# Altium schematic sheet 02-USER_IO.SchDoc
size Tabloid; DocumentNumber: 1; SheetNumber: 2; SheetTotal: 14
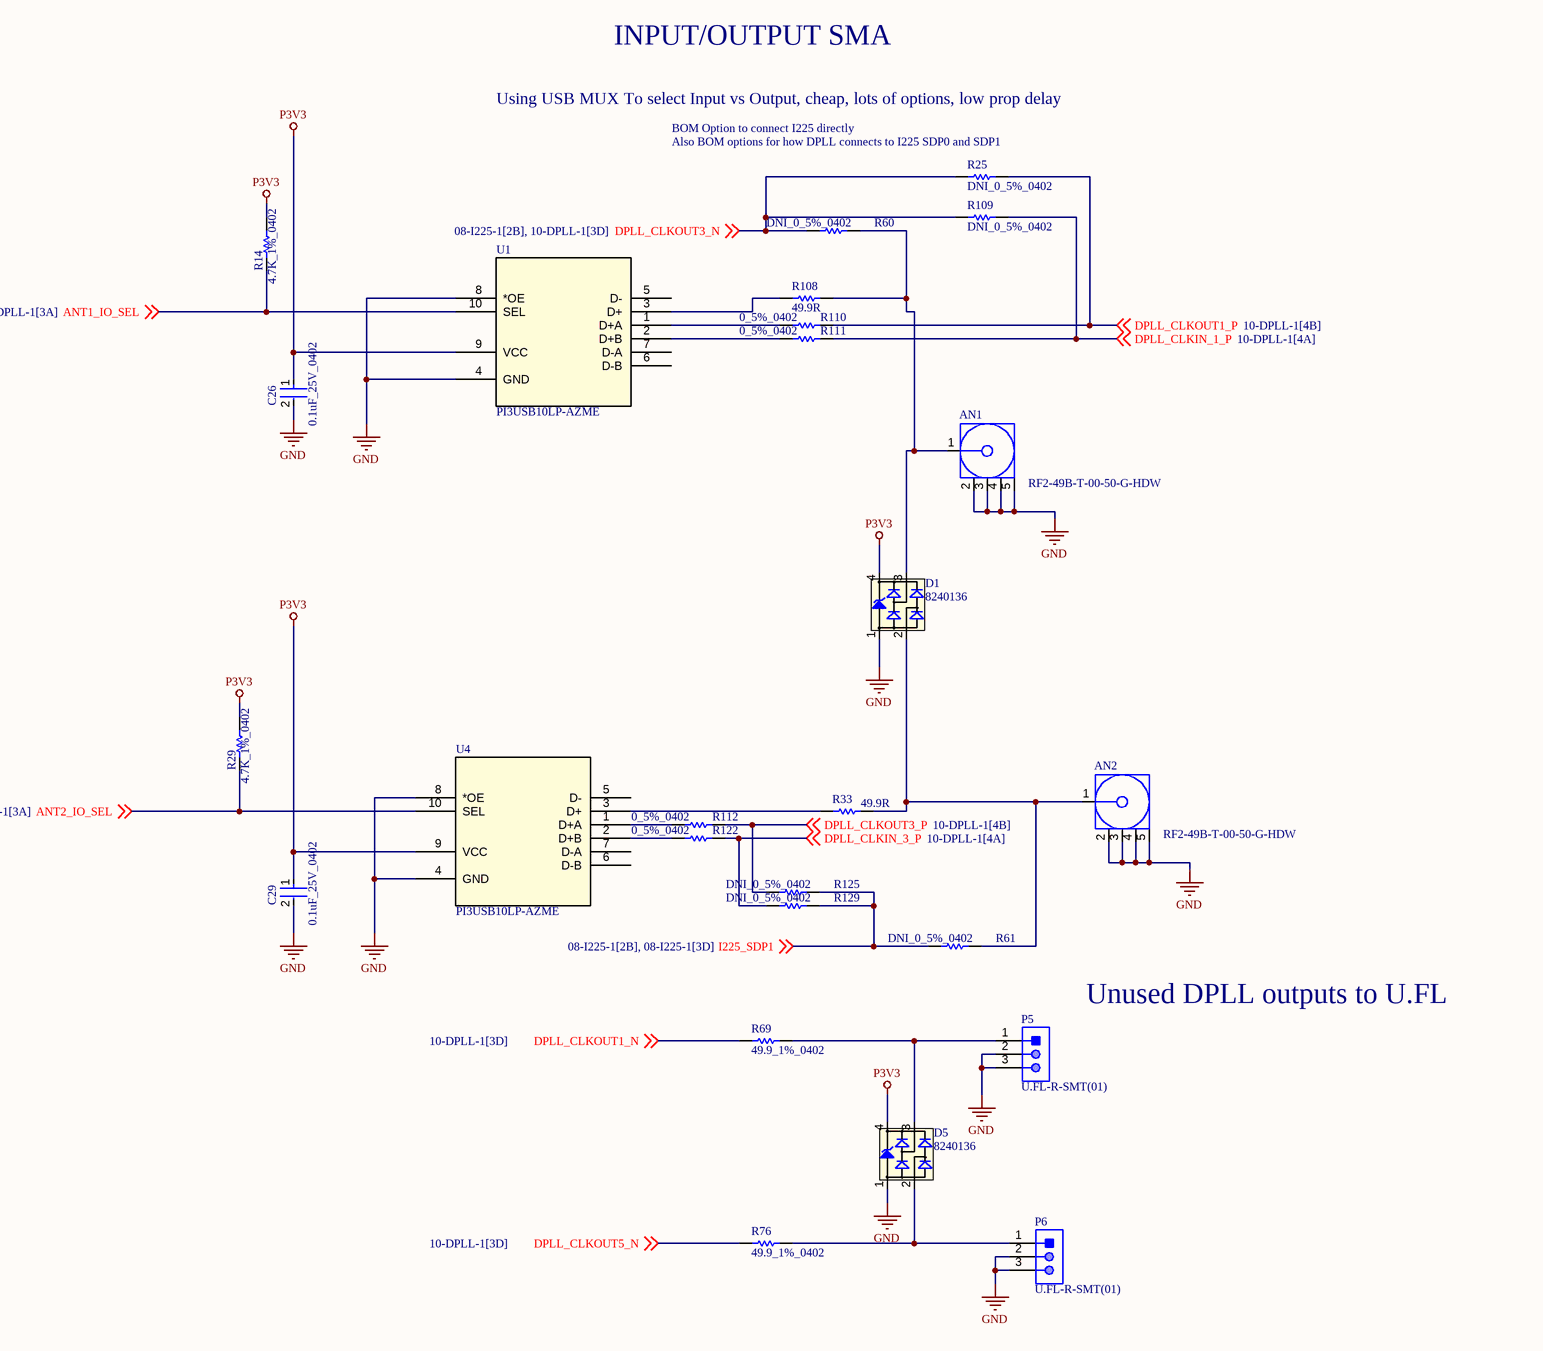
[diagram p0: 02-USER_IO.SchDoc]

## Parts
AN1  RF2-49B-T-00-50-G-HDW  [AMPH-901-143-6RFX_V]
AN2  RF2-49B-T-00-50-G-HDW  [AMPH-901-143-6RFX_V]
C26  0.1uF_25V_0402  [FP-0402-L_1_0_1-W_0_5_0_1-IPC_C]
C29  0.1uF_25V_0402  [FP-0402-L_1_0_1-W_0_5_0_1-IPC_C]
D1  8240136  [SOT143-4L]
D5  8240136  [SOT143-4L]
P5  U.FL-R-SMT(01)  [HRS-U.FL-R-SMT(10)_V]
P6  U.FL-R-SMT(01)  [HRS-U.FL-R-SMT(10)_V]
R14  4.7K_1%_0402  [RESC1005X40X25NL10T10]
R25  DNI_0_5%_0402  [RESC1005X40X25LL10T10]  (no BOM)
R29  4.7K_1%_0402  [RESC1005X40X25NL10T10]
R33  49.9R  [RESC1608X55X25NL10T15]
R60  DNI_0_5%_0402  [RESC1005X40X25LL10T10]  (no BOM)
R61  DNI_0_5%_0402  [RESC1005X40X25LL10T10]  (no BOM)
R69  49.9_1%_0402  [RESC1005X40X25NL10T10]
R76  49.9_1%_0402  [RESC1005X40X25NL10T10]
R108  49.9R  [RESC1608X55X25NL10T15]
R109  DNI_0_5%_0402  [RESC1005X40X25LL10T10]  (no BOM)
R110  0_5%_0402  [RESC1005X40X25LL10T10]
R111  0_5%_0402  [RESC1005X40X25LL10T10]
R112  0_5%_0402  [RESC1005X40X25LL10T10]
R122  0_5%_0402  [RESC1005X40X25LL10T10]
R125  DNI_0_5%_0402  [RESC1005X40X25LL10T10]  (no BOM)
R129  DNI_0_5%_0402  [RESC1005X40X25LL10T10]  (no BOM)
U1  PI3USB10LP-AZME  [ZM10_PER]
U4  PI3USB10LP-AZME  [ZM10_PER]

## Nets
GND: AN1.2 AN1.3 AN1.4 AN1.5 AN2.2 AN2.3 AN2.4 AN2.5 C26.2 C29.2 D1.1(GND) D5.1(GND) P5.2 P5.3 P6.2 P6.3 U1.4(GND) U1.8(*OE) U4.4(GND) U4.8(*OE)
P3V3: C26.1 C29.1 D1.4(VDD) D5.4(VDD) R14.1 R29.1 U1.9(VCC) U4.9(VCC)
ANT1_IO_SEL: R14.2 U1.10(SEL) ; off-sheet ANT1_IO_SEL
ANT2_IO_SEL: R29.2 U4.10(SEL) ; off-sheet ANT2_IO_SEL
DPLL_CLKIN_1_P: R109.1 R111.2 ; off-sheet DPLL_CLKIN_1_P
DPLL_CLKIN_3_P: R122.2 R129.1 ; off-sheet DPLL_CLKIN_3_P
DPLL_CLKOUT1_N: R69.1 ; off-sheet DPLL_CLKOUT1_N
DPLL_CLKOUT1_P: R25.1 R110.2 ; off-sheet DPLL_CLKOUT1_P
DPLL_CLKOUT3_N: R25.2 R60.1 R109.2 ; off-sheet DPLL_CLKOUT3_N
DPLL_CLKOUT3_P: R112.2 R125.1 ; off-sheet DPLL_CLKOUT3_P
DPLL_CLKOUT5_N: R76.1 ; off-sheet DPLL_CLKOUT5_N
I225_SDP1: R61.1 R125.2 R129.2 ; off-sheet I225_SDP1
NetAN1_1: AN1.1 D1.3(I/O2) R60.2 R108.1
NetAN2_1: AN2.1 D1.2(I/O1) R33.2 R61.2
NetD5_2: D5.2(I/O1) P6.1 R76.2
NetD5_3: D5.3(I/O2) P5.1 R69.2
NetR33_1: R33.1 U4.3(D+)
NetR108_2: R108.2 U1.3(D+)
NetR110_1: R110.1 U1.1(D+A)
NetR111_1: R111.1 U1.2(D+B)
NetR112_1: R112.1 U4.1(D+A)
NetR122_1: R122.1 U4.2(D+B)

Not connected (* = marked no-connect by the designer): U1 5(D-) 6(D-B) 7(D-A); U4 5(D-) 6(D-B) 7(D-A)

## Notes on the sheet
- INPUT/OUTPUT SMA
- Using USB MUX To select Input vs Output, cheap, lots of options, low prop delay
- BOM Option to connect I225 directly
- (near R25) Also BOM options for how DPLL connects to I225 SDP0 and SDP1
- Unused DPLL outputs to U.FL
- SHEET
- REV
- timingcard.com <http://timingcard.com>
- DATE
- OF

## Library data of the parts
AN1 AN2 = CMP-2000-05705-1: Coaxial connector, 50 Ohm, -65 to 165 degC, 5-Pin THD, RoHS, Bulk; Manufacturer: Amphenol; Catalog Drawings: 901-143-6RFXMountingHole; 3D Model: 901-143-6RFX.igs; Body Material: Brass; Connector Type: Jack,FemaleSocket; Shield Termination: Solder; Other Names: 901-143-6-RFX9011436RFXARFX1232; Online Catalog: SMA,RFX; Frequency - Max: 18GHz; Body Finish: Gold; Dielectric Material: Polytetrafluoroethylene(PTFE); Center Contact Material: BerylliumCopper; Impedance: 50Ohm; Connector Style: SMA; Mounting Technology: ThroughHole; Mounting Type: ThroughHole,RightAngle; Cable Group: -; Series: -; Package Description: 5-Pin Through Hole Device, Body 7 x 7 mm, Pitch 2.54 mm; Package Reference: 901-143-6RFX; Voltage Rating: -; Standard Package: 1; Fastening Type: Threaded; Housing Color: Gold; Datasheet URL: http://www.amphenolrf.com/downloads/dl/file/id/2712/product/3102/901_143_6rfx_customer_drawing.pdf; Family: CoaxialConnectors(RF); Contact Termination: Solder; Manufacturer URL: http://www.amphenol.com/; Operating Temperature: -65°C~165°C; Category: Connectors,Interconnects; Packaging: Bulk; Features: -; Center Contact Plating: Gold; Datasheet Version: Rev. C, 06/2010; Ingress Protection: -
C26 C29 = CMP-2008-02519-2: General Purpose Ceramic Capacitor, 0402, 100nF, 10%, X7R, 15%, 25V; Package Quantity: 1; Capacitance: 100nF; Min Operating Temperature: -55°C; Voltage: 25V; Voltage Rating: 25V; Construction: Flat; Max Operating Temperature: 125°C; Radiation Hardening: No; Depth: 0.5mm; Thickness: 0.022inch; Voltage Rating (DC): 25V; Number of Pins: 2; Lead Free: Lead Free; Series: -; REACH SVHC: No SVHC; Length: 1mm; Dielectric: X7R; RoHS Compliant: Yes; Mount: Surface Mount; Packaging: Tape and Reel; Case/Package: 0402; Case Code (Imperial): 0402; Termination: SMD/SMT; Width: 0.02inch; Case Code (Metric): 1005; Tolerance: 10%
D1 D5 = CMP-1486-00002-1: TVS Diode WE-TVS-HS, VRWM=3.3V; Manufacturer: Wuerth Elektronik; Reverse Stand Off Voltage: 3.3V; PartNumber: 8240136; ComponentLink1Description: Manufacturer URL; PackageReference: SOT143-4L; ComponentLink1URL: http://www.we-online.com; ComponentLink2Description: Datasheet; ComponentLink2URL: http://katalog.we-online.de/kataloge/eisos/media/pdf/8240136.pdf
P5 P6 = CMP-2000-05151-1: CONN RECPT ULTRA-MINI COAX SMD; Manufacturer: Hirose Electric; Centre Contact Resistance: 25mohm; Voltage Rating V AC: 60V; Female Contact Material: PhosphorBronze; Contact Resistance: 10mohm; Male Contact Material: Brass; Connector Type: UFLCoaxial; Connector Mounting: PCB; Impedance: 50ohm; Insulation Resistance: 500Mohm; Secondary Insulation Material: PBT; Frequency Max: 6GHz; Body Plating: Silver; External Length / Height: 2.5mm; Approval Category: UL94V-0; Female Contact Plating: Gold; Connector Mounting Orientation: PCBoard; VSWR: 1.3; Coaxial Termination: Solder; Body Style: StraightJack; SVHC: NoSVHC(18-Jun-2012); Jacket Material: LCP; Package Reference: U.FL-R-SMT(10); Datasheet Version: Feb-04; Outer Contact Resistance: 10mohm; Contact Plating: Gold; Mounting Type: PCBoard; Flammability Rating: UL94V-0; Operating Frequency Max: 6GHz; Termination Method: Solder; Male Contact Plating: Gold; Package Description: 3-Pin Surface Mount Device, Body 2.6 x 2.6 mm; Operating Temperature Min: -40degC; Manufacturer URL: https://www.hirose.com; Operating Temperature Max: 90degC; Contact Material: PhosphorBronze; Datasheet URL: http://www.farnell.com/datasheets/91524.pdf; Material: PhosphorBronze
R14 R29 = CMP-2002-05217-1: Manufacturer: Bourns; Part Number: CR0402-FX-4701GLF
R25 R60 R61 R109-R112 R122 R125 R129 = CMP-2002-04569-1: Manufacturer: KOA Speer; Part Number: RK73Z1ETTP
R33 R108 = CMP-1659-00036-1: General Purpose Chip Resistor, 49.9 Ohm, +/- 1%, -55 to 155 degC, 0603 (1608 Metric), RoHS, Tape and Reel; Max Supply Voltage: 3.63 V; Case\Package: LQFP; Interface: SPI; Min Supply Voltage: 2.97 V; PackageReference: 0603; Packaging: Tray; ComponentLink2Description: Datasheet; ComponentLink1Description: Manufacturer URL; ComponentLink2URL: https://datasheet.ciiva.com/11808/0900766b80f96399-11808223.pdf; RoHSCompliant: true; Max Operating Temperature: 85 degC; ComponentLink1URL: http://www.yageo.com/; PackageDescription: 2-Pin Surface Mount Device, Body 1.6 x 0.8 mm; DatasheetVersion: Rev. 4, 04/2009; Min Operating Temperature: -40 degC; Package Quantity: 250; Pins: 48
R69 R76 = CMP-2002-04448-1: Part Number: RK73H1ETTP49R9F; Manufacturer: KOA Speer
U1 U4 = PI3USB10LP-AZME: No Description Available; Mfr_Name: Pericom; RefDes: RefDes; Type: Type